# EAGLE design RN XV171 I2C Interface v1.2 (EAGLE 6.4)
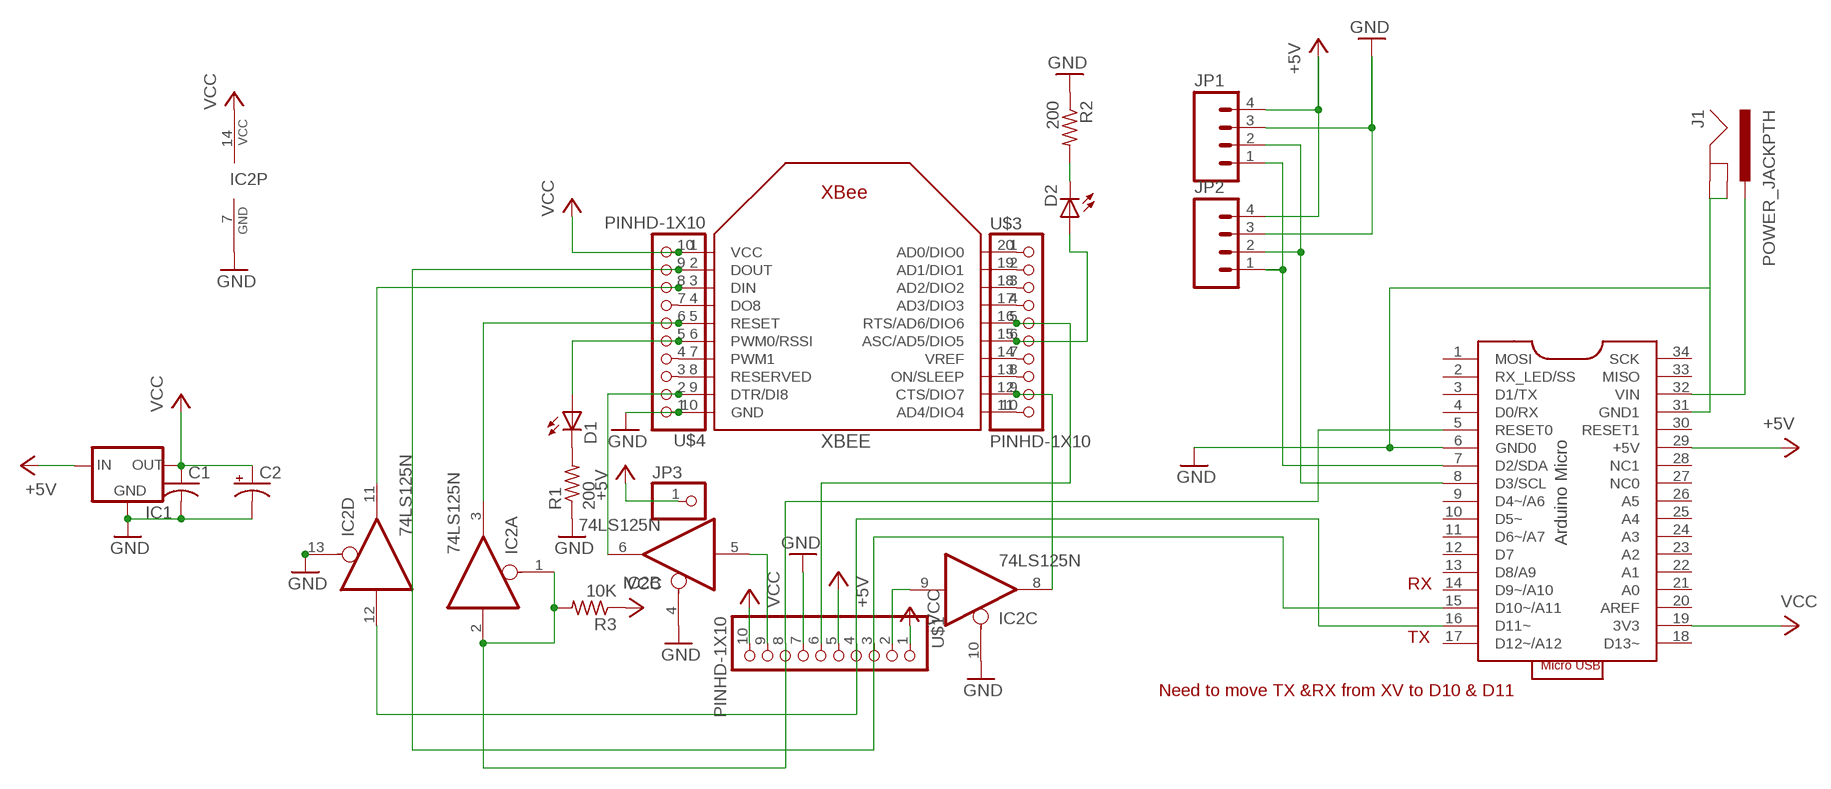
[diagram p0: schematic, sheet 1]

## Parts
C1  C-US025-025X050  [C025-025X050]
C2  CPOL-USE2.5-5  [E2,5-5]
D1  LED3MM  [LED3MM]
D2  LED3MM  [LED3MM]
IC1  MC1700  [TO92]
IC2  74LS125N  [DIL14]
J1  POWER_JACKPTH  [POWER_JACK_PTH]
JP1  M041X04_NO_SILK  [1X04_NO_SILK]
JP2  M041X04_NO_SILK  [1X04_NO_SILK]
JP3  PINHD-1X1  [1X01]
R1  200  R-US_0207/10  [0207/10]
R2  200  R-US_0207/10  [0207/10]
R3  10K  R-US_0207/10  [0207/10]
U$1  PINHD-1X10  [1X10-BIG]
U$3  PINHD-1X10  [1X10-BIG]
U$4  PINHD-1X10  [1X10-BIG]
U$9  ARDUINO-MICRO  [ARDUINO-MICRO-DIP34]
XBEE  XBEE  [XBEE]

## Nets
+5V: IC1.2(IN) JP1.4 JP2.4 JP3.1 U$1.5 U$9.29(+5V)
GND: C1.2 C2.- IC1.1(GND) IC2.4(B:OE) IC2.7(P:GND) IC2.10(C:OE) IC2.13(D:OE) J1.GND J1.GNDBREAK JP1.3 JP2.3 R1.1 R2.1 U$1.7 U$4.1 U$9.6(GND0) U$9.31(GND1) XBEE.10(GND)
N$1: IC2.12(D:I) U$1.4 U$9.16(D11~)
N$2: IC2.11(D:O) U$4.8 XBEE.3(DIN)
N$3: IC2.5(B:I) U$1.9
N$4: IC2.8(C:O) U$3.9 XBEE.12(CTS/DIO7)
N$5: D2.K(C) R2.2
N$6: U$4.7 XBEE.4(DO8)
N$7: D1.A U$4.5 XBEE.6(PWM0/RSSI)
N$8: D1.K(C) R1.2
N$9: D2.A U$3.6 XBEE.15(ASC/AD5/DIO5)
N$10: IC2.6(B:O) U$4.2 XBEE.9(DTR/DI8)
N$11: U$4.3 XBEE.8(RESERVED)
N$12: U$4.4 XBEE.7(PWM1)
N$13: IC2.3(A:O) U$4.6 XBEE.5(RESET)
N$14: U$3.1 XBEE.20(AD0/DIO0)
N$15: U$3.2 XBEE.19(AD1/DIO1)
N$16: U$3.3 XBEE.18(AD2/DIO2)
N$17: U$3.4 XBEE.17(AD3/DIO3)
N$18: U$3.7 XBEE.14(VREF)
N$19: U$3.8 XBEE.13(ON/SLEEP)
N$20: U$3.10 XBEE.11(AD4/DIO4)
N$21: IC2.9(C:I) U$1.2
N$22: JP1.2 JP2.2 U$9.8(D3/SCL)
N$23: JP1.1 JP2.1 U$9.7(D2/SDA)
N$24: J1.PWR U$9.32(VIN)
RESET: IC2.1(A:OE) IC2.2(A:I) R3.2 U$1.8 U$9.5(RESET0)
RTS: U$1.6 U$3.5 XBEE.16(RTS/AD6/DIO6)
TX: U$1.3 U$4.9 U$9.15(D10~/A11) XBEE.2(DOUT)
VCC: C1.1 C2.+ IC1.3(OUT) IC2.14(P:VCC) R3.1 U$1.1 U$1.10 U$4.10 U$9.19(3V3) XBEE.1(VCC)
Unconnected: U$9.1(MOSI) U$9.2(RX_LED/SS) U$9.3(D1/TX) U$9.4(D0/RX) U$9.9(D4~/A6) U$9.10(D5~) U$9.11(D6~/A7) U$9.12(D7) U$9.13(D8/A9) U$9.14(D9~/A10) U$9.17(D12~/A12) U$9.18(D13~) U$9.20(AREF) U$9.21(A0) U$9.22(A1) U$9.23(A2) U$9.24(A3) U$9.25(A4) U$9.26(A5) U$9.27(NC0) U$9.28(NC1) U$9.30(RESET1) U$9.33(MISO) U$9.34(SCK)

## Notes on the sheet
- RX
- TX
- Need to move TX &RX from XV to D10 & D11

## Library data of the parts
C1 = rcl-ez:C-US: CAPACITOR, American symbol
C2 = rcl-ez:CPOL-US: POLARIZED CAPACITOR, American symbol
D1 D2 = minimidi:LED: LED OSRAM: - CHIPLED LG R971, LG N971, LY N971, LG Q971, LY Q971, LO R971, LY R971 LH N974, LH R974 LS Q976, LO Q976, LY Q976 LO Q996 - Hyper CHIPLED LW Q18S LB Q993, LB Q99A, LB R99A - SideLED LS A670, LO A670, LY A670, LG A670, LP A670 LB A673, LV A673, LT A673, LW A673 LH A674 LY A675 LS A676, LA A676, LO A676, LY A676, LW A676 LS A679, LY A679, LG A679 - Hyper Micro SIDELED® LS Y876, LA Y876, LO Y876, LY Y876 LT Y87S - SmartLED LW L88C, LW L88S LB L89C, LB L89S, LG L890 LS L89K, LO L89K, LY L89K LS L896, LA L896, LO L896, LY L896 - TOPLED LS T670, LO T670, LY T670, LG T670, LP T670 LSG T670, LSP T670, LSY T670, LOP T670, LYG T670 LG T671, LOG T671, LSG T671 LB T673, LV T673, LT T673, LW T673 LH T674 LS T676, LA T676, LO T676, LY T676, LB T676, LH T676, LSB T676, LW T676 LB T67C, LV T67C, LT T67C, LS T67K, LO T67K, LY T67K, LW E67C LS E67B, LA E67B, LO E67B, LY E67B, LB E67C, LV E67C, LT E67C LW T67C LS T679, LY T679, LG T679 LS T770, LO T770, LY T770, LG T770, LP T770 LB T773, LV T773, LT T773, LW T773 LH T774 LS E675, LA E675, LY E675, LS T675 LS T776, LA T776, LO T776, LY T776, LB T776 LHGB T686 LT T68C, LB T68C - Hyper Mini TOPLED® LB M676 - Mini TOPLED Santana® LG M470 LS M47K, LO M47K, LY M47K Source: http://www.osram.convergy.de/
IC1 = ulink:MC1700: VOLTAGE REGULATOR
IC2 = 74xx-us:74*125: Quad bus BUFFER, 3-state
J1 = SparkFun-Connectors:POWER_JACK: Power Jack This is the standard 5.5mm barrel jack for power. The PTH is the most common, proven, reliable, footprint. All others are experimental. The Slot footprint only works if the mill layer is transmitted to the PCB fab house so be warned. Spark Fun Electronics SKU : PRT-00119. Mating wall wart : TOL-00298 (and others)
JP1 JP2 = SparkFun-Connectors:M04: Header 4 Standard 4-pin 0.1" header. Use with straight break away headers (SKU : PRT-00116), right angle break away headers (PRT-00553), swiss pins (PRT-00743), machine pins (PRT-00117), and female headers (PRT-00115). Molex polarized connector foot print use with SKU : PRT-08231 with associated crimp pins and housings. 1MM SMD Version SKU: PRT-10208
JP3 = digg:PINHD-1X1: PIN HEADER
R1-R3 = rcl-ez:R-US_: RESISTOR, American symbol
U$1 U$3 U$4 = ybox2:PINHD-1X10
U$9 = rseries:ARDUINO-MICRO
XBEE = ulink:XBEE

## Board
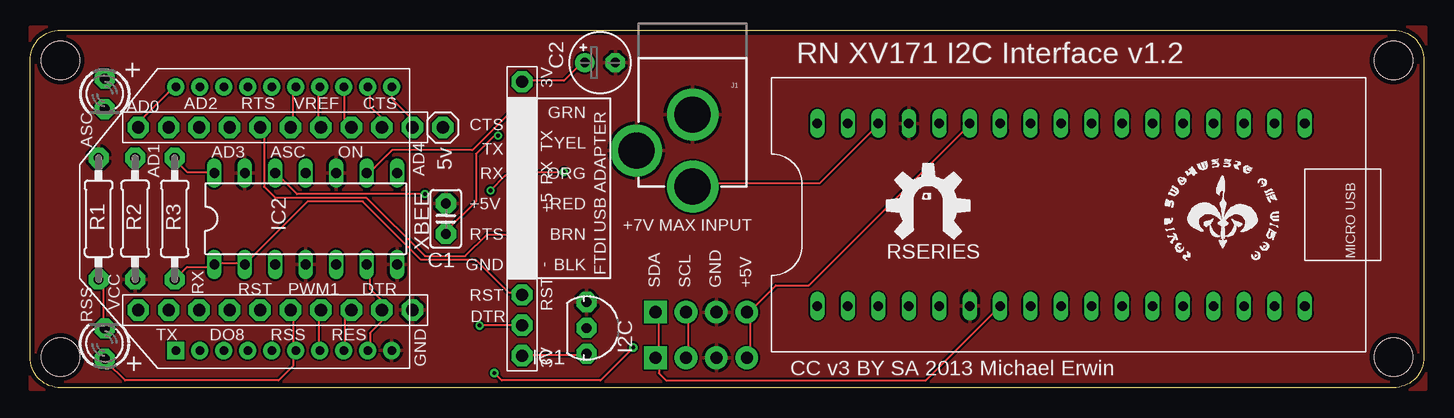
[diagram p1: board, top side]
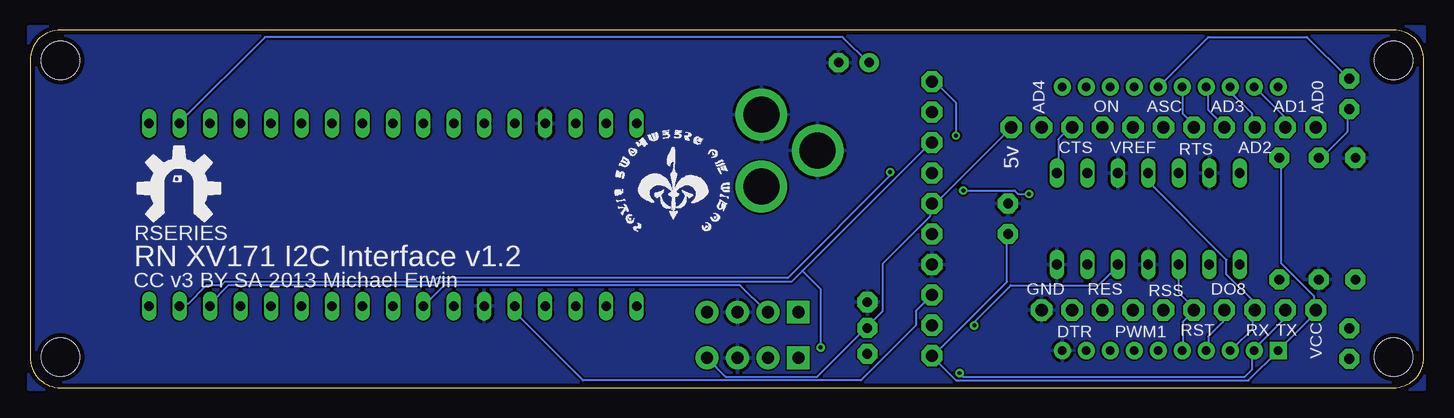
[diagram p2: board, bottom side, seen from below]

Size 116.2 x 29.84 mm. Coordinates in mm from the lower left corner, seen from the top.
Outline: 5.71,29.84 113.67,29.84 arc-90 116.2,27.3 116.2,2.54 arc-90 113.67,0 2.54,0 arc-90 0,2.54 0,27.3 arc-90 2.54,29.84 5.71,29.84
Copper layers (1*16): Top 0.0356mm / dielectric 1.5011mm / Bottom 0.0356mm
Design rules "LaenPCBOrder": minimum track width 6mil, minimum drill 13mil, track to track 6mil, track to pad 6mil, pad to pad 6mil, via to via 6mil, smd to smd 6mil, copper to edge 15mil, drill to drill 6mil, minimum pad ring 7mil, minimum via ring 7mil, stop-mask expansion 4mil, vias tented up to drill 0mil, thermal gap 10mil
Holes 3.2 mm at 2.54,2.54 2.54,27.3 113.67,27.3 113.67,2.54

### Footprints (pad centres in the part's own frame; a part is rotated, then mirrored left to right if it is on the bottom)
C025-025X050 = drill 0.813 pad 1.676 octagon: 1 -1.27,0; 2 1.27,0
E2,5-5 = drill 0.813 pad 1.6: + -1.27,0 | drill 0.813 pad 1.6 octagon: - 1.27,0
LED3MM = drill 0.813 pad 1.676 octagon: A -1.27,0; K 1.27,0
TO92 = drill 0.813 pad 1.676 octagon: 1 -2.159,0; 2 0,0; 3 2.159,0
DIL14 = drill 0.813 long: 1 -7.62,-3.81; 2 -5.08,-3.81; 3 -2.54,-3.81; 4 0,-3.81; 5 2.54,-3.81; 6 5.08,-3.81; 7 7.62,-3.81; 8 7.62,3.81; 9 5.08,3.81; 10 2.54,3.81; 11 0,3.81; 12 -2.54,3.81; 13 -5.08,3.81; 14 -7.62,3.81
POWER_JACK_PTH = drill 2.997 pad 4.318: GND 0,7.7; GNDBREAK 4.7,10.7; PWR 0,13.7
1X04_NO_SILK = drill 1.016 pad 1.88 square: 1 0,0 | drill 1.016 pad 1.88: 2 2.54,0; 3 5.08,0; 4 7.62,0
1X01 = drill 1.016 pad 1.778 octagon: 1 0,0
0207/10 = drill 0.813 pad 1.676 octagon: 1 -5.08,0; 2 5.08,0
1X10-BIG = drill 1.016 pad 1.778 octagon: 1 -11.43,0; 2 -8.89,0; 3 -6.35,0; 4 -3.81,0; 5 -1.27,0; 6 1.27,0; 7 3.81,0; 8 6.35,0; 9 8.89,0; 10 11.43,0
ARDUINO-MICRO-DIP34 = drill 0.8 long: 1 -7.62,19.05; 2 -7.62,16.51; 3 -7.62,13.97; 4 -7.62,11.43; 5 -7.62,8.89; 6 -7.62,6.35; 7 -7.62,3.81; 8 -7.62,1.27; 9 -7.62,-1.27; 10 -7.62,-3.81; 11 -7.62,-6.35; 12 -7.62,-8.89; 13 -7.62,-11.43; 14 -7.62,-13.97; 15 -7.62,-16.51; 16 -7.62,-19.05; 17 -7.62,-21.59; 18 7.62,-21.59; 19 7.62,-19.05; 20 7.62,-16.51; 21 7.62,-13.97; 22 7.62,-11.43; 23 7.62,-8.89; 24 7.62,-6.35; 25 7.62,-3.81; 26 7.62,-1.27; 27 7.62,1.27; 28 7.62,3.81; 29 7.62,6.35; 30 7.62,8.89; 31 7.62,11.43; 32 7.62,13.97; 33 7.62,16.51; 34 7.62,19.05
XBEE = drill 0.7 pad 1.422 square: 1 -11,5.5 | drill 0.7 pad 1.422: 2 -11,3.5; 3 -11,1.5; 4 -11,-0.5; 5 -11,-2.5; 6 -11,-4.5; 7 -11,-6.5; 8 -11,-8.5; 9 -11,-10.5; 10 -11,-12.5; 11 11,-12.5; 12 11,-10.5; 13 11,-8.5; 14 11,-6.5; 15 11,-4.5; 16 11,-2.5; 17 11,-0.5; 18 11,1.5; 19 11,3.5; 20 11,5.5

### Placement (x,y rotation side)
C1  34.67,14.1 90 top
C2  47.52,27.13 0 top
D1  6.22,3.68 90 top
D2  6.22,24.51 270 top
IC1  46.41,4.98 270 top
IC2  22.99,14.1 0 top
J1  55.24,30.48 180 top
JP1  52.15,2.49 0 top
JP2  52.15,6.3 0 top
JP3  34.42,21.72 90 top
R1  5.71,14.1 270 top
R2  8.76,14.1 90 top
R3  12.06,14.1 270 top
U$1  41.02,14.1 270 top
U$2  [RSERIES-OSHW-LOGO-LARGE]  103.78,16.64 0 bottom
U$3  20.45,21.72 0 top
U$4  20.45,6.48 180 top
U$5  [ROYAL-ENGINEERS-OF-NABOO-SMALL]  67.51,12.73 0 bottom
U$7  [ROYAL-ENGINEERS-OF-NABOO-SMALL]  94.49,10.31 0 top
U$8  [RSERIES-OSHW-LOGO-LARGE]  74.88,15.19 0 top
U$9  84.68,14.43 90 top
XBEE  17.65,14.1 90 top

### Tracks (layer width: path | path; a pad name or v marks a point on that pad's centre or on a via)
+5V
  Top 0.152: U$9.29 78.33,21.95 64.92,8.53 62.18,8.53 60.05,6.4 JP2.4 60.05,6.1 60.05,2.74 JP1.4
  Bottom 0.152: JP3.1 34.44,21.64 40.84,15.24 U$1.5 41.15,15.24 41.15,14.33 45.11,10.36 45.11,6.4 46.33,5.18 IC1.2 46.63,4.88 50.6,0.91 58.22,0.91 59.74,2.44 JP1.4
GND
  pour Bottom: -0.03,30.1 116.31,30.1 116.31,-0.13 -0.03,-0.13
  pour Top: 0,30.07 116.36,30.07 116.36,-0.13 0,-0.13
N$1  (via drill 0.33)
  Top 0.152: v44.5,17.98 41.15,17.98 U$1.4 40.84,17.68 39.62,17.68 v38.41,16.46 | v32.92,16.15 22.25,16.15 20.73,17.68 IC2.12
  Bottom 0.152: v44.5,17.98 44.5,17.68 53.03,9.14 82.3,9.14 82.6,8.84 99.97,8.84 100.28,8.53 101.5,8.53 103.02,7.01 103.63,7.01 U$9.16 | v32.92,16.15 33.83,16.15 34.14,16.46 v38.41,16.46
N$2
  Bottom 0.152: IC2.11 22.86,17.68 22.86,17.07 16.46,10.67 16.46,9.45 14.33,7.32 14.33,6.71 U$4.8 14.33,6.4 14.33,4.88 15.85,3.35 XBEE.3
N$3  (via drill 0.33)
  Top 0.152: v37.49,5.18 40.84,5.18 U$1.9
  Bottom 0.152: v37.49,5.18 37.49,5.49 34.44,8.53 27.13,8.53 25.6,10.06 IC2.5
N$4
  Top 0.152: XBEE.12 28.35,24.99 28.35,23.47 29.26,22.55 29.26,21.95 U$3.9
  Bottom 0.152: IC2.8 30.48,17.98 30.48,20.73 29.57,21.64 U$3.9
N$5
  Bottom 0.152: R2.2 8.53,19.2 6.4,21.34 6.4,23.16 D2.K
N$6
  Bottom 0.152: XBEE.4 17.98,3.35 17.98,4.27 16.76,5.49 16.76,6.4 U$4.7
N$7
  Top 0.152: U$4.5 21.95,6.4 21.95,3.35 XBEE.6 21.95,3.05 21.95,1.83 20.73,0.61 7.92,0.61 6.4,2.13 D1.A
N$8
  Top 0.152: D1.K 6.1,5.18 6.1,8.53 5.79,8.84 R1.2
N$9
  Top 0.152: XBEE.15 21.95,24.99 21.95,21.95 U$3.6
  Bottom 0.152: D2.A 6.4,25.91 9.75,29.26 17.98,29.26 21.95,25.3 XBEE.15
N$10
  Top 0.152: IC2.6 28.35,10.06 28.35,8.23 29.26,7.32 29.26,6.71 U$4.2 29.26,6.4 29.26,5.49 28.35,4.57 28.35,3.35 XBEE.9
N$11
  Top 0.152: XBEE.8 26.21,3.35 26.21,6.1 26.52,6.4 U$4.3
N$12
  Top 0.152: XBEE.7 24.08,3.35 24.08,6.4 U$4.4
N$13
  Bottom 0.152: IC2.3 20.42,10.06 20.42,7.92 19.2,6.71 U$4.6 19.2,6.4 20.12,5.49 20.12,3.35 XBEE.5
N$14
  Top 0.152: XBEE.20 11.89,24.99 8.84,21.95 U$3.1
N$15
  Bottom 0.152: XBEE.19 14.02,24.99 11.58,22.55 11.58,21.95 U$3.2
N$16
  Bottom 0.152: XBEE.18 15.85,24.99 15.85,24.38 14.33,22.86 14.33,21.95 U$3.3
N$17
  Bottom 0.152: XBEE.17 17.98,24.99 17.98,23.16 16.76,21.95 U$3.4
N$18
  Top 0.152: XBEE.14 24.08,24.99 24.08,21.95 U$3.7
N$19
  Top 0.152: XBEE.13 26.21,24.99 26.21,22.25 26.52,21.95 U$3.8
N$20
  Top 0.152: XBEE.11 30.18,24.99 30.18,24.08 31.7,22.55 31.7,21.95 U$3.10
N$21
  Top 0.152: IC2.9 28.35,17.98 30.18,19.81 36.88,19.81 39.93,22.86 40.84,22.86 U$1.2
N$22
  Top 0.152: JP1.2 54.86,2.74 54.86,6.1 JP2.2
  Bottom 0.152: U$9.8 83.21,7.01 81.69,8.53 57,8.53 54.86,6.4 JP2.2
N$23
  Top 0.152: U$9.7 80.77,6.71 74.68,0.61 53.03,0.61 52.43,1.22 52.43,2.44 JP1.1 52.43,2.74 52.43,6.1 JP2.1
N$24
  Top 0.152: U$9.32 70.71,21.95 65.84,17.07 55.47,17.07 J1.PWR
RESET
  Top 0.152: R3.2 12.19,9.14 13.11,10.06 15.24,10.06 IC2.1 15.54,10.36 17.68,10.36 IC2.2 17.98,10.36 23.16,15.54 27.74,15.54 32.61,10.67 37.19,10.67 39.93,7.92 40.84,7.92 U$1.8
  Bottom 0.152: U$9.5 75.59,6.71 75.59,6.1 70.1,0.61 46.94,0.61 42.37,5.18 42.37,6.4 41.15,7.62 U$1.8
RTS
  Top 0.152: U$1.6 40.84,12.8 38.1,12.8 36.27,10.97 32.92,10.97 28.04,15.85 20.42,15.85 19.51,16.76 19.51,21.34 19.2,21.64 U$3.5
  Bottom 0.152: XBEE.16 20.12,24.99 20.12,22.86 19.2,21.95 U$3.5
TX  (via drill 0.33)
  Top 0.152: v38.71,1.22 39.32,0.61 47.55,0.61 v50.29,3.35
  Bottom 0.152: U$4.9 11.58,6.4 11.58,5.79 14.02,3.35 XBEE.2 14.33,3.05 14.33,1.52 14.94,0.91 38.41,0.91 v38.71,1.22 | 51.82,9.75 41.15,20.42 U$1.3 | 51.82,9.75 52.73,8.84 81.99,8.84 82.3,8.53 99.67,8.53 101.19,7.01 U$9.15 | v50.29,3.35 50.29,8.23 51.82,9.75
VCC  (via drill 0.33)
  Top 0.152: IC2.14 15.24,17.98 13.11,17.98 12.19,18.9 R3.1 | IC1.3 46.33,2.74 41.15,2.74 U$1.10 | U$1.1 41.15,25.6 44.5,25.6 46.02,27.13 C2.+ | v39.01,21.03 38.71,21.03 37.19,19.51 37.19,15.54 34.75,13.11 C1.1
  Bottom 0.152: R3.1 11.89,18.9 11.89,10.36 9.14,7.62 9.14,6.71 U$4.10 8.84,6.4 11.89,3.35 XBEE.1 12.19,3.05 14.63,0.61 39.01,0.61 40.84,2.44 U$1.10 40.84,2.74 34.75,8.84 34.75,12.8 C1.1 | U$9.19 103.63,22.25 96.62,29.26 48.46,29.26 46.33,27.13 C2.+ | v39.01,21.03 39.01,23.77 40.84,25.6 U$1.1

### Text on the board
tPlace: RN XV171 I2C Interface v1.2 | 3V | GRN | YEL | TX | RX | ORG | +5V | RED | RTS | BRN | +7V MAX INPUT | GND | BLK | RSERIES | MICRO USB | FTDI USB ADAPTER | RST | SDA | SCL | GND | +5V | DTR | I2C | 3V | CC v3 BY SA 2013 Michael Erwin
tNames: + | AD0 | AD2 | RTS | VREF | CTS | ASC | CTS | AD1 | AD3 | ASC | ON | TX | RX | AD4 | 5v | +5 | RX | - | RST | PWM1 | DTR | RST | VCC | RSS | TX | DO8 | RSS | RES | GND | +
bNames: AD0 | AD1 | AD3 | ASC | ON | AD4 | AD2 | VREF | CTS | 5v | RTS | RSERIES | RN XV171 I2C Interface v1.2 | DO8 | RSS | RES | GND | CC v3 BY SA 2013 Michael Erwin | TX | RX | RST | PWM1 | DTR | VCC